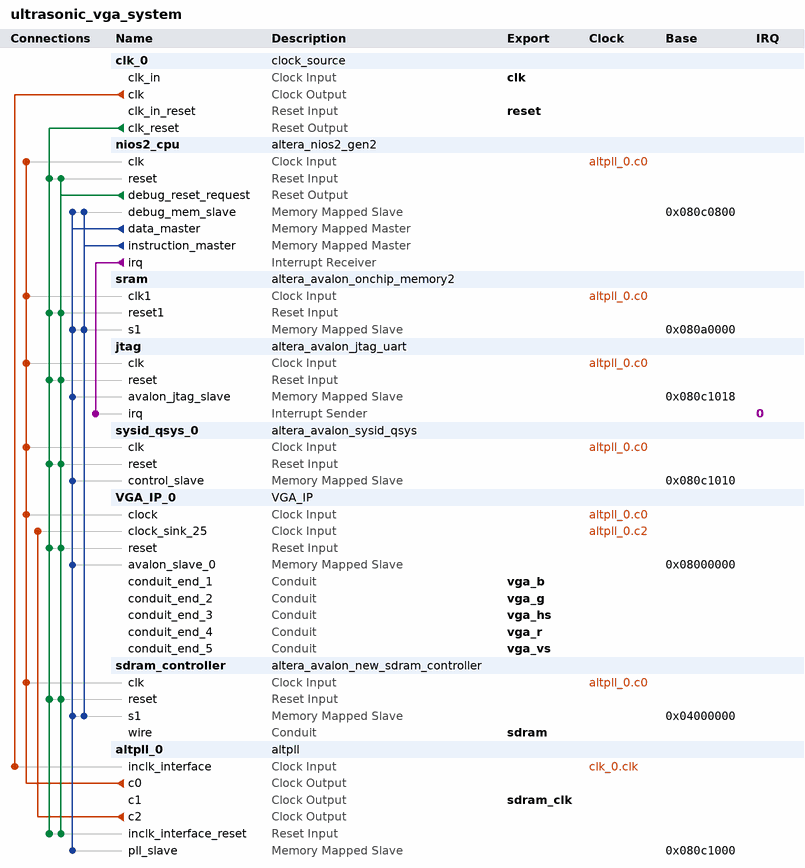
[diagram p0: system contents]
# Platform Designer (Qsys) system ultrasonic_vga_system, MAX 10 10M50DAF484C7G
# Parameters at their usual value, and those the tool derives, are not listed.
package require -exact qsys 18.1
create_system ultrasonic_vga_system
set_project_property DEVICE_FAMILY {MAX 10}
set_project_property DEVICE 10M50DAF484C7G

add_instance clk_0 clock_source 18.1
set_instance_parameter_value clk_0 clockFrequency 50000000

add_instance nios2_cpu altera_nios2_gen2 18.1
set_instance_parameter_value nios2_cpu dcache_size 2048
set_instance_parameter_value nios2_cpu exceptionSlave sdram_controller.s1
set_instance_parameter_value nios2_cpu icache_size 4096
set_instance_parameter_value nios2_cpu impl Tiny
set_instance_parameter_value nios2_cpu resetSlave sdram_controller.s1

add_instance sram altera_avalon_onchip_memory2 18.1
set_instance_parameter_value sram dataWidth 32
set_instance_parameter_value sram dualPort false
set_instance_parameter_value sram initMemContent false
set_instance_parameter_value sram initializationFileName onchip_mem.hex
set_instance_parameter_value sram memorySize 131072

add_instance jtag altera_avalon_jtag_uart 18.1
set_instance_parameter_value jtag simInteractiveOptions NO_INTERACTIVE_WINDOWS

add_instance sysid_qsys_0 altera_avalon_sysid_qsys 18.1
set_instance_parameter_value sysid_qsys_0 id 0

add_instance VGA_IP_0 VGA_IP 1.0

add_instance sdram_controller altera_avalon_new_sdram_controller 18.1
set_instance_parameter_value sdram_controller TAC 5.4
set_instance_parameter_value sdram_controller TRCD 15.0
set_instance_parameter_value sdram_controller TRP 15.0
set_instance_parameter_value sdram_controller casLatency 3
set_instance_parameter_value sdram_controller columnWidth 10
set_instance_parameter_value sdram_controller dataWidth 16
set_instance_parameter_value sdram_controller generateSimulationModel false
set_instance_parameter_value sdram_controller model single_Micron_MT48LC4M32B2_7_chip
set_instance_parameter_value sdram_controller numberOfBanks 4
set_instance_parameter_value sdram_controller numberOfChipSelects 1
set_instance_parameter_value sdram_controller powerUpDelay 100.0
set_instance_parameter_value sdram_controller refreshPeriod 7.8125
set_instance_parameter_value sdram_controller rowWidth 13

add_instance altpll_0 altpll 18.1
set_instance_parameter_value altpll_0 CLK0_DIVIDE_BY 1
set_instance_parameter_value altpll_0 CLK0_MULTIPLY_BY 1
set_instance_parameter_value altpll_0 CLK1_DIVIDE_BY 1
set_instance_parameter_value altpll_0 CLK1_DUTY_CYCLE 50
set_instance_parameter_value altpll_0 CLK1_MULTIPLY_BY 1
set_instance_parameter_value altpll_0 CLK1_PHASE_SHIFT -5000
set_instance_parameter_value altpll_0 CLK2_DIVIDE_BY 2
set_instance_parameter_value altpll_0 CLK2_DUTY_CYCLE 50
set_instance_parameter_value altpll_0 CLK2_MULTIPLY_BY 1
set_instance_parameter_value altpll_0 CLK2_PHASE_SHIFT 0
set_instance_parameter_value altpll_0 INCLK0_INPUT_FREQUENCY 20000
set_instance_parameter_value altpll_0 PORT_ARESET PORT_UNUSED
set_instance_parameter_value altpll_0 PORT_LOCKED PORT_UNUSED
set_instance_parameter_value altpll_0 PORT_clk1 PORT_USED
set_instance_parameter_value altpll_0 PORT_clk2 PORT_USED
set_instance_parameter_value altpll_0 PORT_clk3 PORT_UNUSED

# connections
add_connection altpll_0.c0 jtag.clk clock
add_connection altpll_0.c0 nios2_cpu.clk clock
add_connection altpll_0.c0 sdram_controller.clk clock
add_connection altpll_0.c0 sram.clk1 clock
add_connection altpll_0.c0 sysid_qsys_0.clk clock
add_connection altpll_0.c0 VGA_IP_0.clock clock
add_connection altpll_0.c2 VGA_IP_0.clock_sink_25 clock
add_connection clk_0.clk altpll_0.inclk_interface clock
add_connection clk_0.clk_reset altpll_0.inclk_interface_reset reset
add_connection clk_0.clk_reset jtag.reset reset
add_connection clk_0.clk_reset nios2_cpu.reset reset
add_connection clk_0.clk_reset sdram_controller.reset reset
add_connection clk_0.clk_reset sram.reset1 reset
add_connection clk_0.clk_reset sysid_qsys_0.reset reset
add_connection clk_0.clk_reset VGA_IP_0.reset reset
add_connection nios2_cpu.debug_reset_request altpll_0.inclk_interface_reset reset
add_connection nios2_cpu.debug_reset_request jtag.reset reset
add_connection nios2_cpu.debug_reset_request nios2_cpu.reset reset
add_connection nios2_cpu.debug_reset_request sdram_controller.reset reset
add_connection nios2_cpu.debug_reset_request sram.reset1 reset
add_connection nios2_cpu.debug_reset_request sysid_qsys_0.reset reset
add_connection nios2_cpu.debug_reset_request VGA_IP_0.reset reset
add_connection nios2_cpu.data_master altpll_0.pll_slave avalon
set_connection_parameter_value nios2_cpu.data_master/altpll_0.pll_slave baseAddress 0x080c1000
add_connection nios2_cpu.data_master jtag.avalon_jtag_slave avalon
set_connection_parameter_value nios2_cpu.data_master/jtag.avalon_jtag_slave baseAddress 0x080c1018
add_connection nios2_cpu.data_master nios2_cpu.debug_mem_slave avalon
set_connection_parameter_value nios2_cpu.data_master/nios2_cpu.debug_mem_slave baseAddress 0x080c0800
add_connection nios2_cpu.data_master sdram_controller.s1 avalon
set_connection_parameter_value nios2_cpu.data_master/sdram_controller.s1 baseAddress 0x04000000
add_connection nios2_cpu.data_master sram.s1 avalon
set_connection_parameter_value nios2_cpu.data_master/sram.s1 baseAddress 0x080a0000
add_connection nios2_cpu.data_master sysid_qsys_0.control_slave avalon
set_connection_parameter_value nios2_cpu.data_master/sysid_qsys_0.control_slave baseAddress 0x080c1010
add_connection nios2_cpu.data_master VGA_IP_0.avalon_slave_0 avalon
set_connection_parameter_value nios2_cpu.data_master/VGA_IP_0.avalon_slave_0 baseAddress 0x08000000
add_connection nios2_cpu.instruction_master nios2_cpu.debug_mem_slave avalon
set_connection_parameter_value nios2_cpu.instruction_master/nios2_cpu.debug_mem_slave baseAddress 0x080c0800
add_connection nios2_cpu.instruction_master sdram_controller.s1 avalon
set_connection_parameter_value nios2_cpu.instruction_master/sdram_controller.s1 baseAddress 0x04000000
add_connection nios2_cpu.instruction_master sram.s1 avalon
set_connection_parameter_value nios2_cpu.instruction_master/sram.s1 baseAddress 0x080a0000
add_connection nios2_cpu.irq jtag.irq interrupt
set_connection_parameter_value nios2_cpu.irq/jtag.irq irqNumber 0

# exported interfaces
add_interface clk clock sink
set_interface_property clk EXPORT_OF clk_0.clk_in
add_interface reset reset sink
set_interface_property reset EXPORT_OF clk_0.clk_in_reset
add_interface sdram conduit end
set_interface_property sdram EXPORT_OF sdram_controller.wire
add_interface sdram_clk clock source
set_interface_property sdram_clk EXPORT_OF altpll_0.c1
add_interface vga_b conduit end
set_interface_property vga_b EXPORT_OF VGA_IP_0.conduit_end_1
add_interface vga_g conduit end
set_interface_property vga_g EXPORT_OF VGA_IP_0.conduit_end_2
add_interface vga_hs conduit end
set_interface_property vga_hs EXPORT_OF VGA_IP_0.conduit_end_3
add_interface vga_r conduit end
set_interface_property vga_r EXPORT_OF VGA_IP_0.conduit_end_4
add_interface vga_vs conduit end
set_interface_property vga_vs EXPORT_OF VGA_IP_0.conduit_end_5

set_interconnect_requirement {$system} qsys_mm.clockCrossingAdapter HANDSHAKE
set_interconnect_requirement {$system} qsys_mm.enableEccProtection FALSE
set_interconnect_requirement {$system} qsys_mm.insertDefaultSlave FALSE
set_interconnect_requirement {$system} qsys_mm.maxAdditionalLatency 1

save_system ultrasonic_vga_system.qsys
